# Altium schematic sheet Power Isolation.SchDoc: Power Isolation
size 292 x 193 mm; SheetNumber: 3; SheetTotal: 8
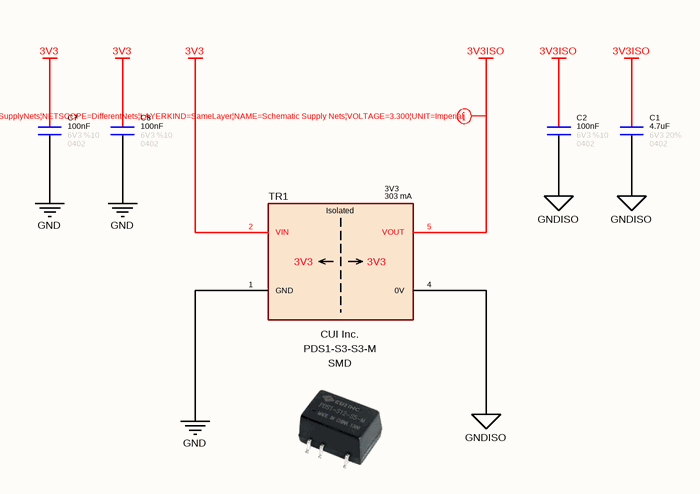
[diagram p0: Power Isolation.SchDoc]

## Parts
C1  value 4.7uF  Tolerance: 20%  Case: 0402  Voltage: 6V3  [CAPACITOR_0402]  (hidden comment: Capacitor - 4.7uF [0402] (Ceramic))
C2  value 100nF  Tolerance: %10  Voltage: 6V3  Case: 0402  [CAPACITOR_0402]  (hidden comment: Capacitor - 100nF [0402] (Ceramic))
C7  value 100nF  Tolerance: %10  Voltage: 6V3  Case: 0402  [CAPACITOR_0402]  (hidden comment: Capacitor - 100nF [0402] (Ceramic))
C8  value 100nF  Tolerance: %10  Voltage: 6V3  Case: 0402  [CAPACITOR_0402]  (hidden comment: Capacitor - 100nF [0402] (Ceramic))
TR1  Output Current: 303 mA  Output Voltage: 3V3  Manufacturer Name: CUI Inc.  Case: SMD  [PDS1-Sx-Sx-M]  (hidden comment: PDS1-S3-S3-M)

## Nets
3V3: C7.2 C8.2 TR1.2(VIN)
3V3ISO: C1.2 C2.2 TR1.5(VOUT)
GND: C7.1 C8.1 TR1.1(GND)
GNDISO: C1.1 C2.1 TR1.4(0V)

Not connected (* = marked no-connect by the designer): TR1 8(Terminator)

## Layout directives
rule Supply Nets [Voltage = 3.300]: 3V3ISO

## Notes on the sheet
- © 2021 All rights reserved.
  This document may not, in whole or in part, be copied, photocopied, reproduced, translated or converted to any electronic or machine readable from without prior written permission of Mehmet Günce Akkoyun.
  Engineer contact : akkoyun@me.com
- Property of
- Engineer :
- Date :
- Size :
- A4
- Time :
- Project :
- Page :
- /
- Customer :
- Product ID :
- Module ID :
- Version :
- File :
- Revision :
- (in symbol Transformator - PDS1-Sx-Sx-M) Isolated

## Library data of the parts
C1 = Capacitor - 4.7uF [0402-6V3]: Multilayer Ceramic Capacitors - SMD - 6V3 4.7uF X5R 0402 20%; Manufacturer Part Number: C0402C475M9PACTU; Manufacturer Name: KEMET
C2 C7 C8 = Capacitor - 100nF [0402-6V3]: Capacitor - 100nF [0402-6V3] (Ceramic); Manufacturer Name: AVX; Manufacturer Part Number: 04026D104KAT4A; ComponentLink1Description: Mouser; ComponentLink1URL: https://www.mouser.com.tr/ProductDetail/AVX/04026D104KAT4A?qs=sGAEpiMZZMs0AnBnWHyRQPg4iYkCw7IMED%2F4kpqgf7w%3D; ComponentLink2Description: DataSheet; ComponentLink2URL: https://www.mouser.com.tr/datasheet/2/40/cx5r-776519.pdf
TR1 = Transformator - PDS1-Sx-Sx-M: Module DC-DC 3.3VIN 1-OUT 3.3V 0.303A 1W 5-Pin SMD Module; Manufacturer Part Number: PDS1-S3-S3-M